# Altium schematic sheet OpAmp.SchDoc
size A3; Organization: Altium Limited; Address1: L3, 12a Rodborough Rd; Address2: Frenchs Forest; Address3: NSW; Address4: Australia 2086
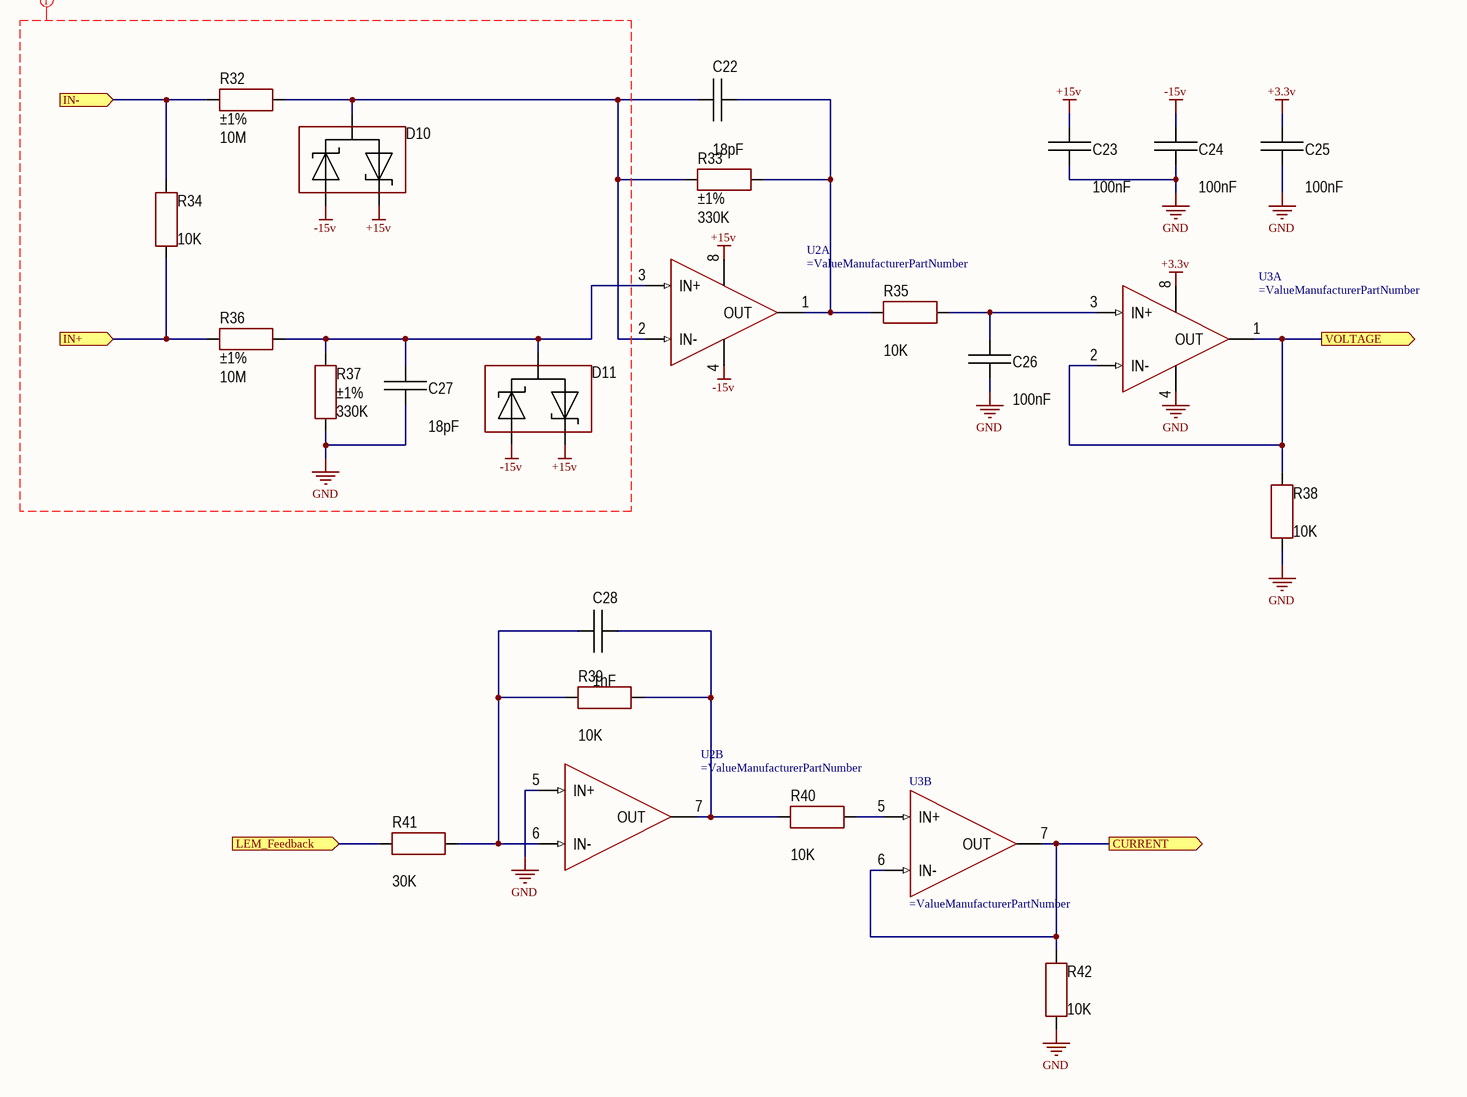
[diagram p0: OpAmp.SchDoc]

## Parts
C22  value 18pF  [CAP: 1206]
C23  value 100nF  [CAP: 1206]
C24  value 100nF  [CAP: 1206]
C25  value 100nF  [CAP: 1206]
C26  value 100nF  [CAP: 1206]
C27  value 18pF  [CAP: 1206]
C28  value 1nF  [CAP: 1206]
D10  (no value)  [SOT23]
D11  (no value)  [SOT23]
R32  value 10M  Tolerance: ±1%  [CFR-50]
R33  value 330K  Tolerance: ±1%  [RES: 1206]
R34  value 10K  [CPF-3]
R35  value 10K  [RES: 1206]
R36  value 10M  Tolerance: ±1%  [CFR-50]
R37  value 330K  Tolerance: ±1%  [RES: 1206]
R38  value 10K  [RES: 1206]
R39  value 10K  [RES: 1206]
R40  value 10K  [RES: 1206]
R41  value 30K  [RES: 1206]
R42  value 10K  [RES: 1206]
U2  (no value)  [8-SOIC]  (parts A,B of 2)
U3  (no value)  [8-SOIC]  (parts A,B of 2)

## Ports
CURRENT (out), IN+ (in), IN- (in), LEM_Feedback (in), VOLTAGE (out)

## Nets
+3.3v: C25.2 U3.8(V+)
+15v: C23.2 D10.2 D11.2 U2.8(V+)
-15v: C24.2 D10.1 D11.1 U2.4(V-)
GND: C23.1 C24.1 C25.1 C26.1 C27.1 R37.1 R38.1 R42.1 U2.5(IN+) U3.4(V-)
CURRENT: R42.2 U3.6(IN-) U3.7(OUT) ; port CURRENT
IN+: R34.1 R36.1 ; port IN+
IN-: R32.2 R34.2 ; port IN-
LEM_Feedback: R41.1 ; port LEM_Feedback
VOLTAGE: R38.2 U3.1(OUT) U3.2(IN-) ; port VOLTAGE
NetC22_1: C22.1 R33.2 R35.1 U2.1(OUT)
NetC22_2: C22.2 D10.3 R32.1 R33.1 U2.2(IN-)
NetC26_2: C26.2 R35.2 U3.3(IN+)
NetC27_2: C27.2 D11.3 R36.2 R37.2 U2.3(IN+)
NetC28_1: C28.1 R39.2 R40.1 U2.7(OUT)
NetC28_2: C28.2 R39.1 R41.2 U2.6(IN-)
NetR40_2: R40.2 U3.5(IN+)

## Layout directives
net class Hi_Voltage: +15v, -15v, GND

## Notes on the sheet
- Title
- Size:
- Date:
- File:
- A0
- Number:
- Time:
- Revision:
- Sheet
- of

## Library data of the parts
C22 C27 = Ceramic_1206: Manufacturer: Yageo; PartNumber: CC1206KRX7R9BB104; ValueManufacturerPartNumber: Ceramic capacitor, 18pF, 1206; TypeCapacitor: Ceramic capacitor; Tolerance: ±10%; TypeDielectric: X7R; Voltage: 50V; Package: 1206; HelpURL: https://www.digikey.com/product-detail/en/yageo/CC1206KRX7R9BB104/311-1179-1-ND/303089; Temperature: -55...+125°C
C23-C26 = Ceramic_1206: Manufacturer: Yageo; PartNumber: CC1206KRX7R9BB104; ValueManufacturerPartNumber: Ceramic capacitor, 100nF, 1206; TypeCapacitor: Ceramic capacitor; Tolerance: ±10%; TypeDielectric: X7R; Voltage: 50V; Package: 1206; HelpURL: https://www.digikey.com/product-detail/en/yageo/CC1206KRX7R9BB104/311-1179-1-ND/303089; Temperature: -55...+125°C
C28 = Ceramic_1206: Manufacturer: Yageo; PartNumber: CC1206KRX7R9BB104; ValueManufacturerPartNumber: Ceramic capacitor, 1nF, 1206; TypeCapacitor: Ceramic capacitor; Tolerance: ±10%; TypeDielectric: X7R; Voltage: 50V; Package: 1206; HelpURL: https://www.digikey.com/product-detail/en/yageo/CC1206KRX7R9BB104/311-1179-1-ND/303089; Temperature: -55...+125°C
D10 D11 = Schottky_array: Manufacturer: Diodes Incorporated; ValueManufacturerPartNumber: BAS40-04, SOT23-3; PartNumber: BAS40-04; TypeDiode: Schottky array; Voltage: 40V; Current: 120mA; VoltageDrop: 1V; RecoveryTime: 15pF; Package: SOT23-3; HelpURL: https://www.digikey.com/product-detail/en/diodes-incorporated/MBR0580S1-7/MBR0580S1-7DICT-ND/5080371; Temperature: -55...+150°C
R32 R36 = Resistor_1206: Manufacturer: Yageo; PartNumber: RC1206JR-07100RL; ValueManufacturerPartNumber: Resistor, 10M, CFR-50; Power: 0.25W; Package: CFR-50; HelpURL: https://www.digikey.com/product-detail/en/yageo/RC1206JR-07100RL/311-100ERCT-ND/732153; Temperature: -55...+125°C; TypeResistor: Resistor
R33 R37 = Resistor_1206: Manufacturer: Yageo; PartNumber: RC1206JR-07100RL; ValueManufacturerPartNumber: Resistor, 330K, 1206; Power: 0.25W; Package: 1206; HelpURL: https://www.digikey.com/product-detail/en/yageo/RC1206JR-07100RL/311-100ERCT-ND/732153; Temperature: -55...+125°C; TypeResistor: Resistor
R34 = Resistor_1206: Manufacturer: Yageo; PartNumber: RC1206JR-07100RL; ValueManufacturerPartNumber: Resistor, 10K, CPF-3; Power: 3W; Tolerance: ±5%; Package: CPF-3; HelpURL: https://www.digikey.com/product-detail/en/yageo/RC1206JR-07100RL/311-100ERCT-ND/732153; Temperature: -55...+125°C; TypeResistor: Resistor
R35 R38-R40 R42 = Resistor_1206: Manufacturer: Yageo; PartNumber: RC1206JR-07100RL; ValueManufacturerPartNumber: Resistor, 10K, 1206; Power: 0.25W; Tolerance: ±5%; Package: 1206; HelpURL: https://www.digikey.com/product-detail/en/yageo/RC1206JR-07100RL/311-100ERCT-ND/732153; Temperature: -55...+125°C; TypeResistor: Resistor
R41 = Resistor_1206: Manufacturer: Yageo; PartNumber: RC1206JR-07100RL; ValueManufacturerPartNumber: Resistor, 30K, 1206; Power: 0.25W; Tolerance: ±5%; Package: 1206; HelpURL: https://www.digikey.com/product-detail/en/yageo/RC1206JR-07100RL/311-100ERCT-ND/732153; Temperature: -55...+125°C; TypeResistor: Resistor
U2 = LF253: ValueManufacturerPartNumber: LF253, SOIC-8; Package: SOIC-8; PartNumber: LF253
U3 = MC33202: ValueManufacturerPartNumber: MC33202, SOIC-8; Package: SOIC-8; PartNumber: MC33202